# EAGLE design COPY VestibularVR H1-module v1.0 (EAGLE 9.6.2)
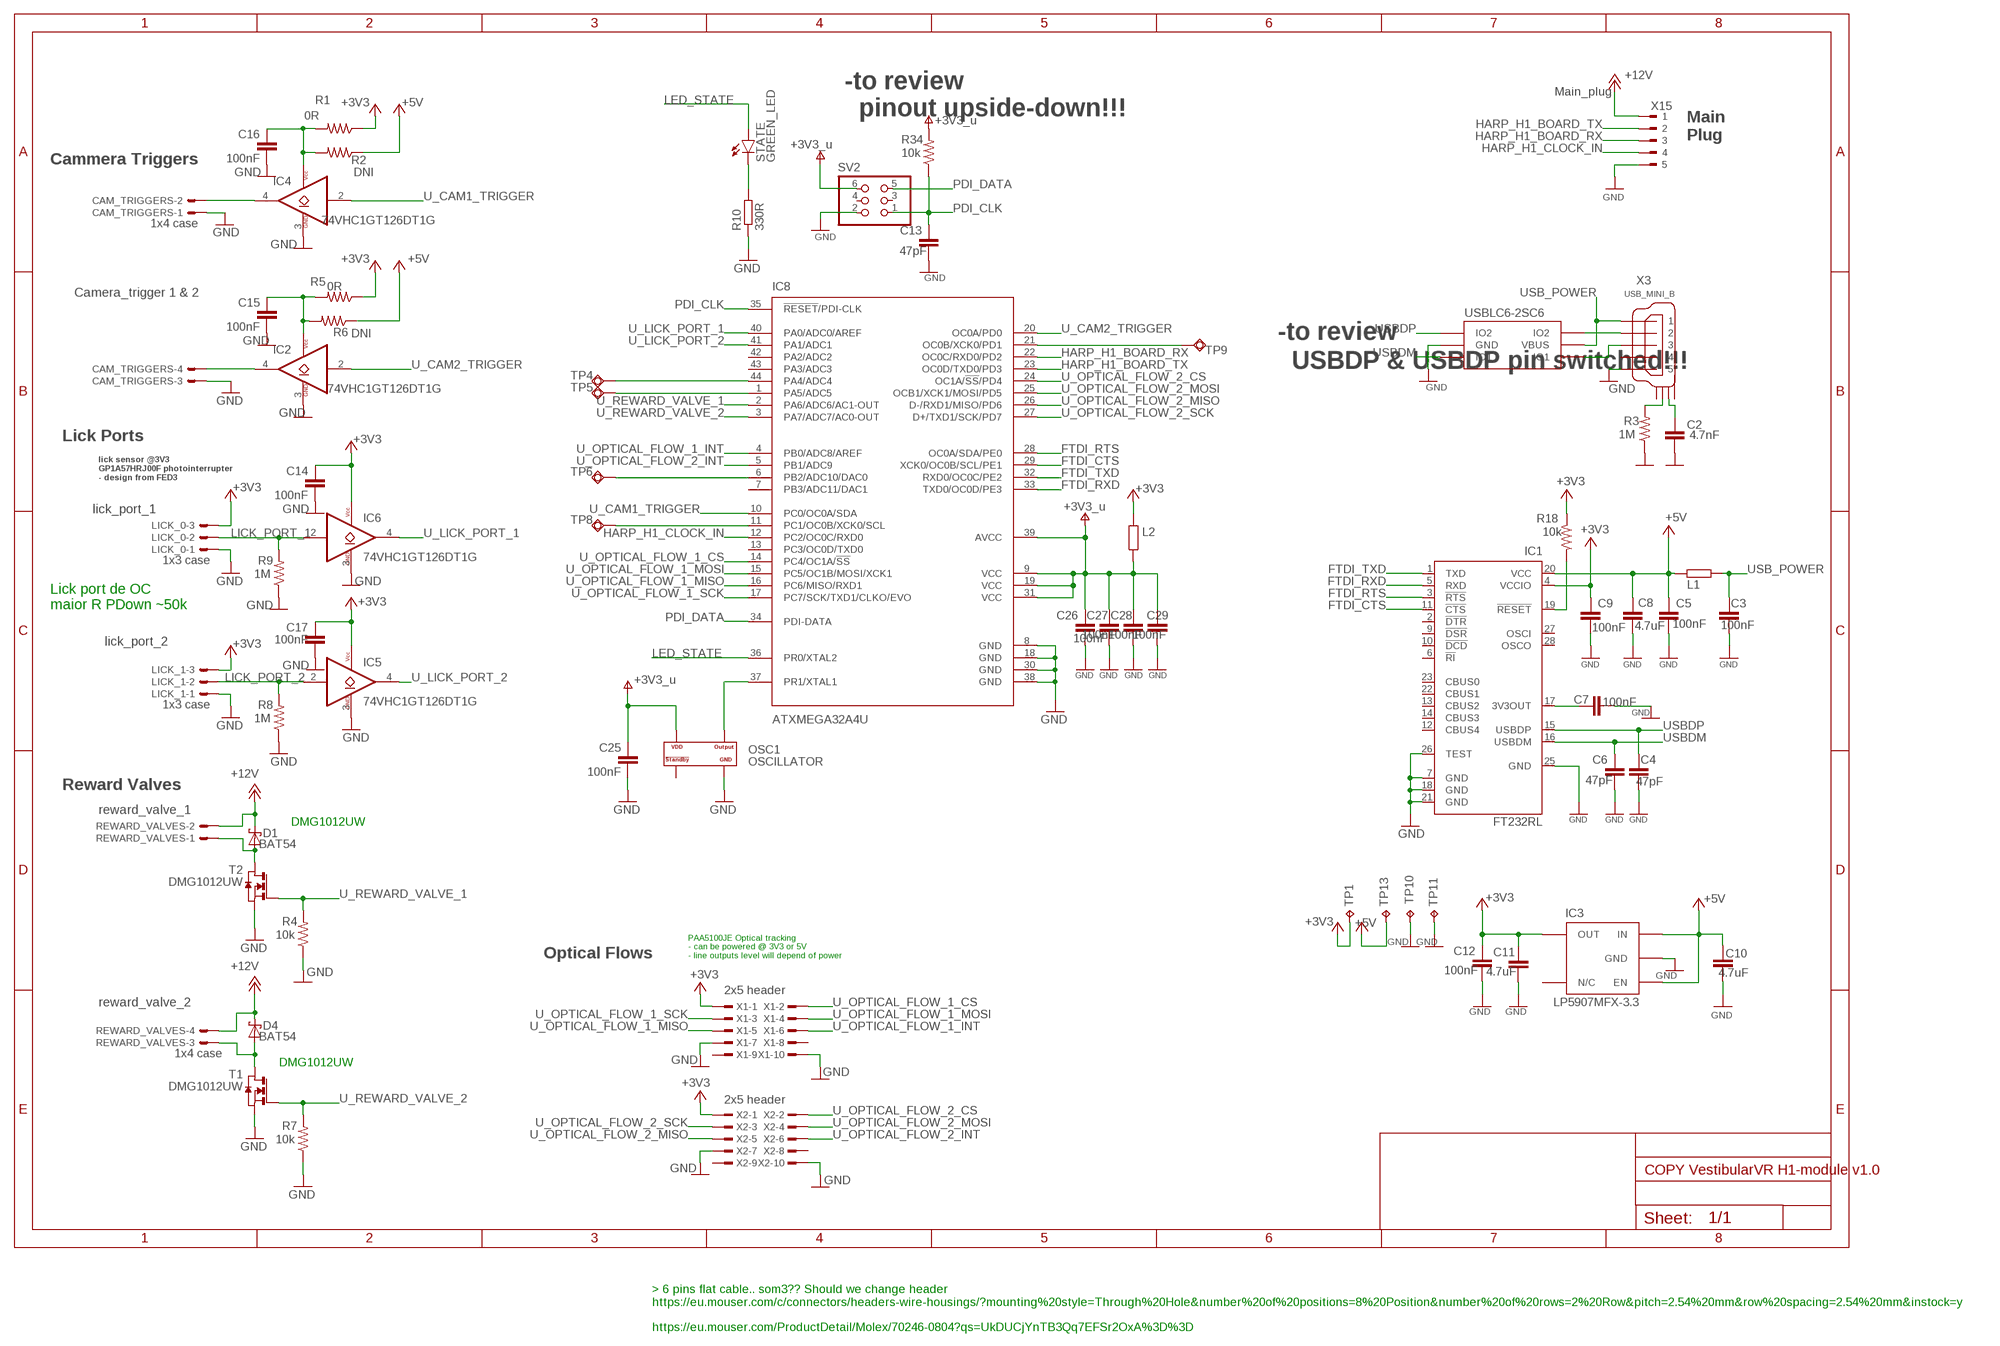
[diagram p0: schematic, sheet 1]

## Parts
C2  4.7nF  C-EUC0402K  [C0402K]
C3  100nF  C-EUC0402K  [C0402K]
C4  47pF  C-EUC0402K  [C0402K]
C5  100nF  C-EUC0402K  [C0402K]
C6  47pF  C-EUC0402K  [C0402K]
C7  100nF  C-EUC0402K  [C0402K]
C8  4.7uF  C-EUC0603  [C0603]
C9  100nF  C-EUC0402K  [C0402K]
C10  4.7uF  C-EUC0603K  [C0603K]
C11  4.7uF  C-EUC0603K  [C0603K]
C12  100nF  C-EUC0402K  [C0402K]
C13  47pF  C-EUC0402K  [C0402K]
C14  100nF  C-EUC0402K  [C0402K]
C15  100nF  C-EUC0402K  [C0402K]
C16  100nF  C-EUC0402K  [C0402K]
C17  100nF  C-EUC0402K  [C0402K]
C25  100nF  C-EUC0402K  [C0402K]
C26  100nF  C-EUC0402K  [C0402K]
C27  100nF  C-EUC0402K  [C0402K]
C28  100nF  C-EUC0402K  [C0402K]
C29  100nF  C-EUC0402K  [C0402K]
CAM_TRIGGERS  1x4 case  22-23-2041  [22-23-2041]
D1  BAT54  [SOT23]
D4  BAT54  [SOT23]
IC1  FT232RL  [SSOP28]
IC2  74VHC1GT126DT1G  74LVC1G07DBV  [SOT23-5]
IC3  LP5907MFX-3.3  TLV700XX  [TSOT23-5]
IC4  74VHC1GT126DT1G  74LVC1G07DBV  [SOT23-5]
IC5  74VHC1GT126DT1G  74LVC1G07DBV  [SOT23-5]
IC6  74VHC1GT126DT1G  74LVC1G07DBV  [SOT23-5]
IC7  USBLC6-2SC6  [SOT23-6L]
IC8  ATXMEGA32A4U  XMEGA-A4_AT-XMEGA-XXA4-AUTQFP44  [TQFP44]
L1  40R@100MHz  R-EU_R0603  [R0603]
L2  40R@100MHz  R-EU_R0603  [R0603]
LICK_0  1x3 case  22-23-2031  [22-23-2031]
LICK_1  1x3 case  22-23-2031  [22-23-2031]
OSC1  OSCILLATOR  [OSCILLATOR_3.2X2.5]
R1  0R  R-US_R0402  [R0402@1]
R2  DNI  R-US_R0402  [R0402@1]
R3  1M  R-US_R0402  [R0402@1]
R4  10k  R-US_R0402  [R0402@1]
R5  0R  R-US_R0402  [R0402@1]
R6  DNI  R-US_R0402  [R0402@1]
R7  10k  R-US_R0402  [R0402@1]
R8  1M  R-US_R0402  [R0402@1]
R9  1M  R-US_R0402  [R0402@1]
R10  330R  R-EU_R0402  [R0402]
R18  10k  R-US_R0402  [R0402@1]
R34  10k  R-US_R0402  [R0402@1]
REWARD_VALVES  1x4 case  22-23-2041  [22-23-2041]
STATE  GREEN_LED  LEDCHIP-LED0603  [CHIP-LED0603]
SV2  PINHD-2X3  [2X03]
T1  DMG1012UW  DMG1012UW-7  [SOT323]
T2  DMG1012UW  DMG1012UW-7  [SOT323]
TP1  NO_COMPONENT  TPB1,27  [B1,27]
TP4  NO_COMPONENT  TPSQTP11R  [TP11R]
TP5  NO_COMPONENT  TPSQTP11R  [TP11R]
TP6  NO_COMPONENT  TPSQTP11R  [TP11R]
TP8  NO_COMPONENT  TPSQTP11R  [TP11R]
TP9  NO_COMPONENT  TPSQTP11R  [TP11R]
TP10  NO_COMPONENT  TPB1,27  [B1,27]
TP11  NO_COMPONENT  TPB1,27  [B1,27]
TP13  NO_COMPONENT  TPB1,27  [B1,27]
X1  2x5 header  TSW-105-02-S-D  [TSW-105-02-S-D]
X2  2x5 header  TSW-105-02-S-D  [TSW-105-02-S-D]
X3  USB_MINI_B  [240-0002-1]
X15  Main_plug  90G-5  [90G-5]

## Nets
+3V3: C9.1 C11.1 C12.1 C14.1 C17.1 IC1.4(VCCIO) IC3.5(OUT) IC5.5(VCC) IC6.5(VCC) L2.2 LICK_0.3 LICK_1.3 R1.1 R5.1 R18.1 TP1.TP X1.1 X2.1
+3V3_U: C25.1 C26.1 C27.1 C28.1 C29.1 IC8.9(VCC) IC8.19(VCC) IC8.31(VCC) IC8.39(AVCC) L2.1 OSC1.P$4(VDD) R34.2 SV2.6 ; supply symbol labelled +3V3_u
+5V: C5.1 C8.1 C10.1 IC1.20(VCC) IC3.1(IN) IC3.3(EN) L1.1 R2.1 R6.1 TP13.TP
+12V: D1.3(C) D4.3(C) REWARD_VALVES.2 REWARD_VALVES.4 X15.1
FTDI_CTS: IC1.11(!CTS) IC8.29(XCK0/OC0B/SCL/PE1)
FTDI_RTS: IC1.3(!RTS) IC8.28(OC0A/SDA/PE0)
FTDI_RXD: IC1.5(RXD) IC8.33(TXD0/OC0D/PE3)
FTDI_TXD: IC1.1(TXD) IC8.32(RXD0/OC0C/PE2)
GND: C2.2 C3.2 C4.2 C5.2 C6.2 C7.2 C8.2 C9.2 C10.2 C11.2 C12.2 C13.2 C14.2 C15.2 C16.2 C17.2 C25.2 C26.2 C27.2 C28.2 C29.2 CAM_TRIGGERS.1 CAM_TRIGGERS.3 IC1.7(GND) IC1.18(GND) IC1.21(GND) IC1.25(GND) IC1.26(TEST) IC2.3(GND) IC3.2(GND) IC4.3(GND) IC5.3(GND) IC6.3(GND) IC7.P$2(GND) IC8.8(GND) IC8.18(GND) IC8.30(GND) IC8.38(GND) LICK_0.1 LICK_1.1 OSC1.P$2(GND) R3.1 R4.1 R7.1 R8.1 R9.1 R10.1 SV2.2 T1.2(S) T2.2(S) TP10.TP TP11.TP X1.7 X1.10 X2.7 X2.10 X3.P$5 X15.5
HARP_H1_BOARD_RX: IC8.22(OC0C/RXD0/PD2) X15.3
HARP_H1_BOARD_TX: IC8.23(OC0D/TXD0/PD3) X15.2
HARP_H1_CLOCK_IN: IC8.12(PC2/OC0C/RXD0) X15.4
LED_STATE: IC8.36(PR0/XTAL2) STATE.A
LICK_PORT_1: IC6.2(A) LICK_0.2 R9.2
LICK_PORT_2: IC5.2(A) LICK_1.2 R8.2
N$1: R3.2 X3.SHIELD_2
N$2: IC7.P$4(IO2) X3.P$2
N$3: IC7.P$6(IO1) X3.P$3
N$4: CAM_TRIGGERS.4 IC2.4(Y)
N$5: C16.1 IC4.5(VCC) R1.2 R2.2
N$6: D4.1(A) REWARD_VALVES.3 T1.3(D)
N$8: CAM_TRIGGERS.2 IC4.4(Y)
N$9: R10.2 STATE.C
N$11: IC8.44(PA4/ADC4) TP4.TP
N$12: IC8.1(PA5/ADC5) TP5.TP
N$13: IC8.6(PB2/ADC10/DAC0) TP6.TP
N$14: C15.1 IC2.5(VCC) R5.2 R6.2
N$15: C2.1 X3.SHIELD_3
N$17: IC8.11(PC1/OC0B/XCK0/SCL) TP8.TP
N$18: IC8.21(OC0B/XCK0/PD1) TP9.TP
N$38: C7.1 IC1.17(3V3OUT)
N$68: D1.1(A) REWARD_VALVES.1 T2.3(D)
N$175: IC1.19(!RESET) R18.2
OSC2: IC8.37(PR1/XTAL1) OSC1.P$3(OUTPUT)
PDI_CLK: C13.1 IC8.35(!RESET!/PDI-CLK) R34.1 SV2.1
PDI_DATA: IC8.34(PDI-DATA) SV2.5
U_CAM1_TRIGGER: IC4.2(A) IC8.10(PC0/OC0A/SDA)
U_CAM2_TRIGGER: IC2.2(A) IC8.20(OC0A/PD0)
U_LICK_PORT_1: IC6.4(Y) IC8.40(PA0/ADC0/AREF)
U_LICK_PORT_2: IC5.4(Y) IC8.41(PA1/ADC1)
U_OPTICAL_FLOW_1_CS: IC8.14(PC4/OC1A/!SS) X1.2
U_OPTICAL_FLOW_1_INT: IC8.4(PB0/ADC8/AREF) X1.6
U_OPTICAL_FLOW_1_MISO: IC8.16(PC6/MISO/RXD1) X1.5
U_OPTICAL_FLOW_1_MOSI: IC8.15(PC5/OC1B/MOSI/XCK1) X1.4
U_OPTICAL_FLOW_1_SCK: IC8.17(PC7/SCK/TXD1/CLKO/EVO) X1.3
U_OPTICAL_FLOW_2_CS: IC8.24(OC1A/!SS!/PD4) X2.2
U_OPTICAL_FLOW_2_INT: IC8.5(PB1/ADC9) X2.6
U_OPTICAL_FLOW_2_MISO: IC8.26(D-/RXD1/MISO/PD6) X2.5
U_OPTICAL_FLOW_2_MOSI: IC8.25(OCB1/XCK1/MOSI/PD5) X2.4
U_OPTICAL_FLOW_2_SCK: IC8.27(D+/TXD1/SCK/PD7) X2.3
U_REWARD_VALVE_1: IC8.2(PA6/ADC6/AC1-OUT) R4.2 T2.1(G)
U_REWARD_VALVE_2: IC8.3(PA7/ADC7/AC0-OUT) R7.2 T1.1(G)
USB_POWER: C3.1 IC7.P$5(VBUS) L1.2 X3.P$1
USBDM: C6.1 IC1.16(USBDM) IC7.P$1(IO1)
USBDP: C4.1 IC1.15(USBDP) IC7.P$3(IO2)
Unconnected: IC1.2(!DTR) IC1.6(!RI) IC1.9(!DSR) IC1.10(!DCD) IC1.12(CBUS4) IC1.13(CBUS2) IC1.14(CBUS3) IC1.22(CBUS1) IC1.23(CBUS0) IC1.27(OSCI) IC1.28(OSCO) IC2.1(NC) IC3.4(N/C) IC4.1(NC) IC5.1(NC) IC6.1(NC) IC8.7(PB3/ADC11/DAC1) IC8.13(PC3/OC0D/TXD0) IC8.42(PA2/ADC2) IC8.43(PA3/ADC3) OSC1.P$1(STANDBY#) SV2.3 SV2.4 X1.8 X1.9 X2.8 X2.9 X3.P$4 X3.SHIELD_1 X3.SHIELD_4

## Notes on the sheet
- -to review
    pinout upside-down!!!
- Main 
  Plug
- Cammera Triggers
- Camera_trigger 1 & 2
- -to review
    USBDP & USBDP pin switched!!!
- Lick Ports
- lick sensor @3V3
  GP1A57HRJ00F photointerrupter
  - design from FED3
- lick_port_1
- Lick port de OC
  maior R PDown ~50k
- lick_port_2
- Reward Valves
- reward_valve_1
- DMG1012UW
- Optical Flows
- PAA5100JE Optical tracking
  - can be powered @ 3V3 or 5V
  - line outputs level will depend of power
- reward_valve_2
- DMG1012UW
- > 6 pins flat cable.. som3?? Should we change header
  https://eu.mouser.com/c/connectors/headers-wire-housings/?mounting%20style=Through%20Hole&number%20of%20positions=8%20Position&number%20of%20rows=2%20Row&pitch=2.54%20mm&row%20spacing=2.54%20mm&instock=y
  
  https://eu.mouser.com/ProductDetail/Molex/70246-0804?qs=UkDUCjYnTB3Qq7EFSr2OxA%3D%3D

## Library data of the parts
C2 = rcl:C-EU: CAPACITOR, European symbol; MPN: CC0402KRX7R8BB472; OEPS: OEPS010001
C3 C5 C7 C9 C12 C14-C17 C25-C29 = rcl:C-EU: CAPACITOR, European symbol; DIGIKEY_PN: 445-5932-1-ND; MPN: C1005X7R1H104K050BB; NOTES: -; OEPS: OEPS010004; TYPE: SMD
C4 C6 C13 = rcl:C-EU: CAPACITOR, European symbol; MPN: 04025A470JAT2A; OEPS: OEPS080013
C8 = rcl:C-EU: CAPACITOR, European symbol; MPN: C1608X6S1C475K080AC; OEPS: OEPS010018
C10 C11 = rcl:C-EU: CAPACITOR, European symbol; MPN: C1608X6S1C475K080AC; NOTES: -; OEPS: OEPS010018; TYPE: SMD
CAM_TRIGGERS REWARD_VALVES = con-molex:22-23-2041: .100" (2.54mm) Center Header - 4 Pin; MF: -; MPN: 282834-4; OC_FARNELL: 1462920; OC_NEWARK: 38C0355; OEPS: OEPS070036
D1 D4 = diode:BAT54: Schottky Diodes Source: Fairchild .. BAT54.pdf; MPN: BAT54SLT1G; OEPS: OEPS030003
IC1 = VestibularVR H1-module v1.0:FT232R: UART/FIFO IC; MPN: FT232RL; OEPS: OEPS080013
IC2 IC4-IC6 = VestibularVR H1-module v1.0:74LVC1G07: Single Buffer/Driver With Open-Drain Output; MPN: M74VHC1GT126DT1G; OEPS: OEPS080017
IC3 = VestibularVR H1-module v1.0:TLV700XX: C REG LINEAR 3.3V 200MA SOT23-5; MPN: LP5907MFX-3.3/NOPB; NOTES: -; OEPS: OEPS080016; TYPE: SMD
IC7 = VestibularVR H1-module v1.0:USBLC6-2SC6: TVS DIODE 5.25VWM 17VC SOT23-6; MPN: USBLC6-2SC6; OEPS: OEPS030010
IC8 = VestibularVR H1-module v1.0:XMEGA-A4_AT-XMEGA-XXA4-AU: ATxMega a4 Serie; DIGIKEY_PN: ATXMEGA32A4U-AURCT-ND; MOUSER_PN: 556-ATXMEGA32A4U-AU; MPN: ATXMEGA32A4U-AUR; OEPS: OEPS080012
L1 L2 = rcl:R-EU_: RESISTOR, European symbol; MPN: MI0805K400R-10; OEPS: OEPS040003; SPICEPREFIX: R
LICK_0 LICK_1 = con-molex:22-23-2031: .100" (2.54mm) Center Header - 3 Pin; MF: -; MPN: 282834-3; OC_FARNELL: 1462950; OC_NEWARK: 30C0862; OEPS: OEPS070035
OSC1 = VestibularVR H1-module v1.0:OSCILLATOR: XTAL OSC TCXO 32.0000MHZ HCMOS; MPN: DSC1001CI5-032.0000; OEPS: OEPS080018
R1 R5 = rcl:R-US_: RESISTOR, American symbol; MPN: RC0402JR-070RL; OEPS: OEPS020001
R2 R6 = rcl:R-US_: RESISTOR, American symbol; MPN: DNI; OEPS: DNI
R3 R8 R9 = rcl:R-US_: RESISTOR, American symbol; DIGIKEY_PN: 541-1.00MLCT-ND; MPN: CRCW04021M00FKED; OEPS: OEPS020026
R4 R7 R18 R34 = rcl:R-US_: RESISTOR, American symbol; DIGIKEY_PN: 541-10.0KLDKR-ND; MPN: CRCW040210K0FKED; OEPS: OEPS020030
R10 = rcl:R-EU_: RESISTOR, European symbol; MPN: RC0402FR-07330RL; OEPS: OEPS020037; SPICEPREFIX: R
STATE = led:LED: LED OSRAM: - CHIPLED LG R971, LG N971, LY N971, LG Q971, LY Q971, LO R971, LY R971 LH N974, LH R974 LS Q976, LO Q976, LY Q976 LO Q996 - Hyper CHIPLED LW Q18S LB Q993, LB Q99A, LB R99A - SideLED LS A670, LO A670, LY A670, LG A670, LP A670 LB A673, LV A673, LT A673, LW A673 LH A674 LY A675 LS A676, LA A676, LO A676, LY A676, LW A676 LS A679, LY A679, LG A679 - Hyper Micro SIDELED® LS Y876, LA Y876, LO Y876, LY Y876 LT Y87S - SmartLED LW L88C, LW L88S LB L89C, LB L89S, LG L890 LS L89K, LO L89K, LY L89K LS L896, LA L896, LO L896, LY L896 - TOPLED LS T670, LO T670, LY T670, LG T670, LP T670 LSG T670, LSP T670, LSY T670, LOP T670, LYG T670 LG T671, LOG T671, LSG T671 LB T673, LV T673, LT T673, LW T673 LH T674 LS T676, LA T676, LO T676, LY T676, LB T676, LH T676, LSB T676, LW T676 LB T67C, LV T67C, LT T67C, LS T67K, LO T67K, LY T67K, LW E67C LS E67B, LA E67B, LO E67B, LY E67B, LB E67C, LV E67C, LT E67C LW T67C LS T679, LY T679, LG T679 LS T770, LO T770, LY T770, LG T770, LP T770 LB T773, LV T773, LT T773, LW T773 LH T774 LS E675, LA E675, LY E675, LS T675 LS T776, LA T776, LO T776, LY T776, LB T776 LHGB T686 LT T68C, LB T68C - Hyper Mini TOPLED® LB M676 - Mini TOPLED Santana® LG M470 LS M47K, LO M47K, LY M47K Source: http://www.osram.convergy.de LUXEON: - LUMILED® LXK2-PW12-R00, LXK2-PW12-S00, LXK2-PW14-U00, LXK2-PW14-V00 LXK2-PM12-R00, LXK2-PM12-S00, LXK2-PM14-U00 LXK2-PE12-Q00, LXK2-PE12-R00, LXK2-PE12-S00, LXK2-PE14-T00, LXK2-PE14-U00 LXK2-PB12-K00, LXK2-PB12-L00, LXK2-PB12-M00, LXK2-PB14-N00, LXK2-PB14-P00, LXK2-PB14-Q00 LXK2-PR12-L00, LXK2-PR12-M00, LXK2-PR14-Q00, LXK2-PR14-R00 LXK2-PD12-Q00, LXK2-PD12-R00, LXK2-PD12-S00 LXK2-PH12-R00, LXK2-PH12-S00 LXK2-PL12-P00, LXK2-PL12-Q00, LXK2-PL12-R00 Source: www.luxeon.com KINGBRIGHT: KA-3528ASYC Source: www.kingbright.com; MPN: LTST-C191KGKT; OEPS: OEPS030005
SV2 = Connector:PINHD-2X3: PIN HEADER; CATEGORY: CONNECTOR; MPN: 609-3210-ND; OEPS: OEPS070015; SUB-CATEGORY: PIN-HEADER
T1 T2 = VestibularVR H1-module v1.0:DMG1012UW-7: N-CHANNEL ENHANCEMENT MODE MOSFET; MPN: DMG1012UW-7; OEPS: OEPS060010
TP1 TP10 TP11 TP13 = testpad:TP: Test pad
TP4-TP6 TP8 TP9 = testpad:TPSQ: Test pad
X1 X2 = con-samtec:TSW-105-02-S-D: THROUGH-HOLE .025" SQ POST HEADER Source: Samtec TSW.pdf; MPN: 2x5 header; OC_FARNELL: unknown; OC_NEWARK: unknown; OEPS: n.a.
X3 = VestibularVR H1-module v1.0:USB_MINI_B: CONN RCPT USB2.0 MINI B SMD R/A; MPN: UX60-MB-5S8; OEPS: OEPS070021
X15 = con-weidmueller-sl35:90G-5: WEIDMUELLER CLAMP CONNECTOR; MPN: 20.155MH/5-E; OC_FARNELL: unknown; OC_NEWARK: unknown; OEPS: OEPS070037

## Net classes
0 default: clearance 0.205 mm

## Board
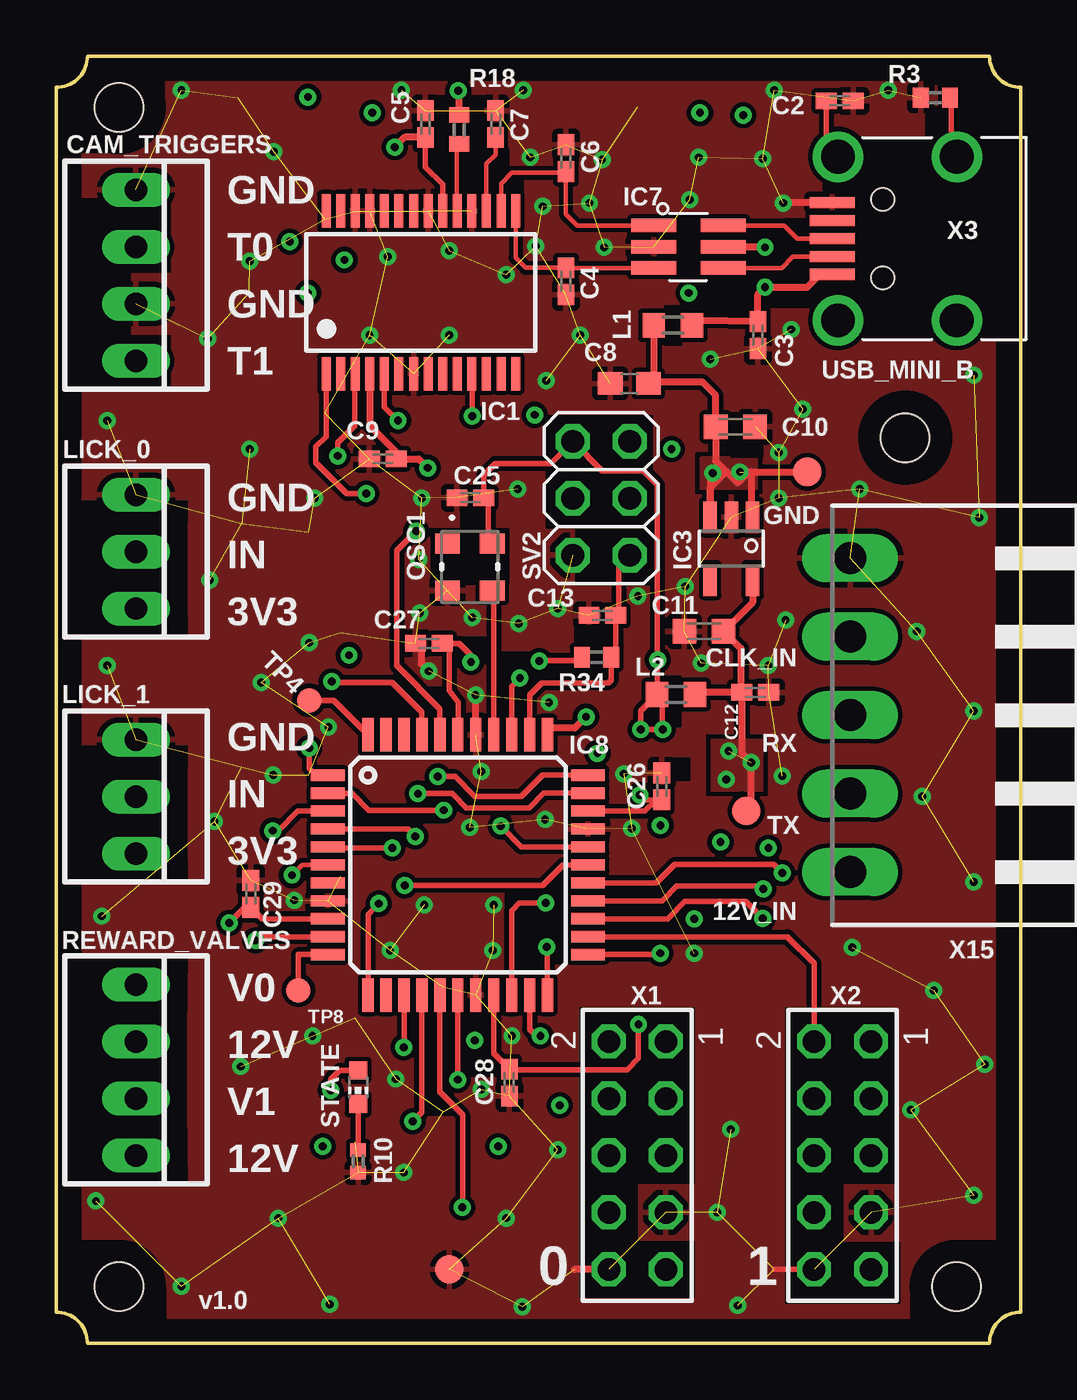
[diagram p1: board, top side]
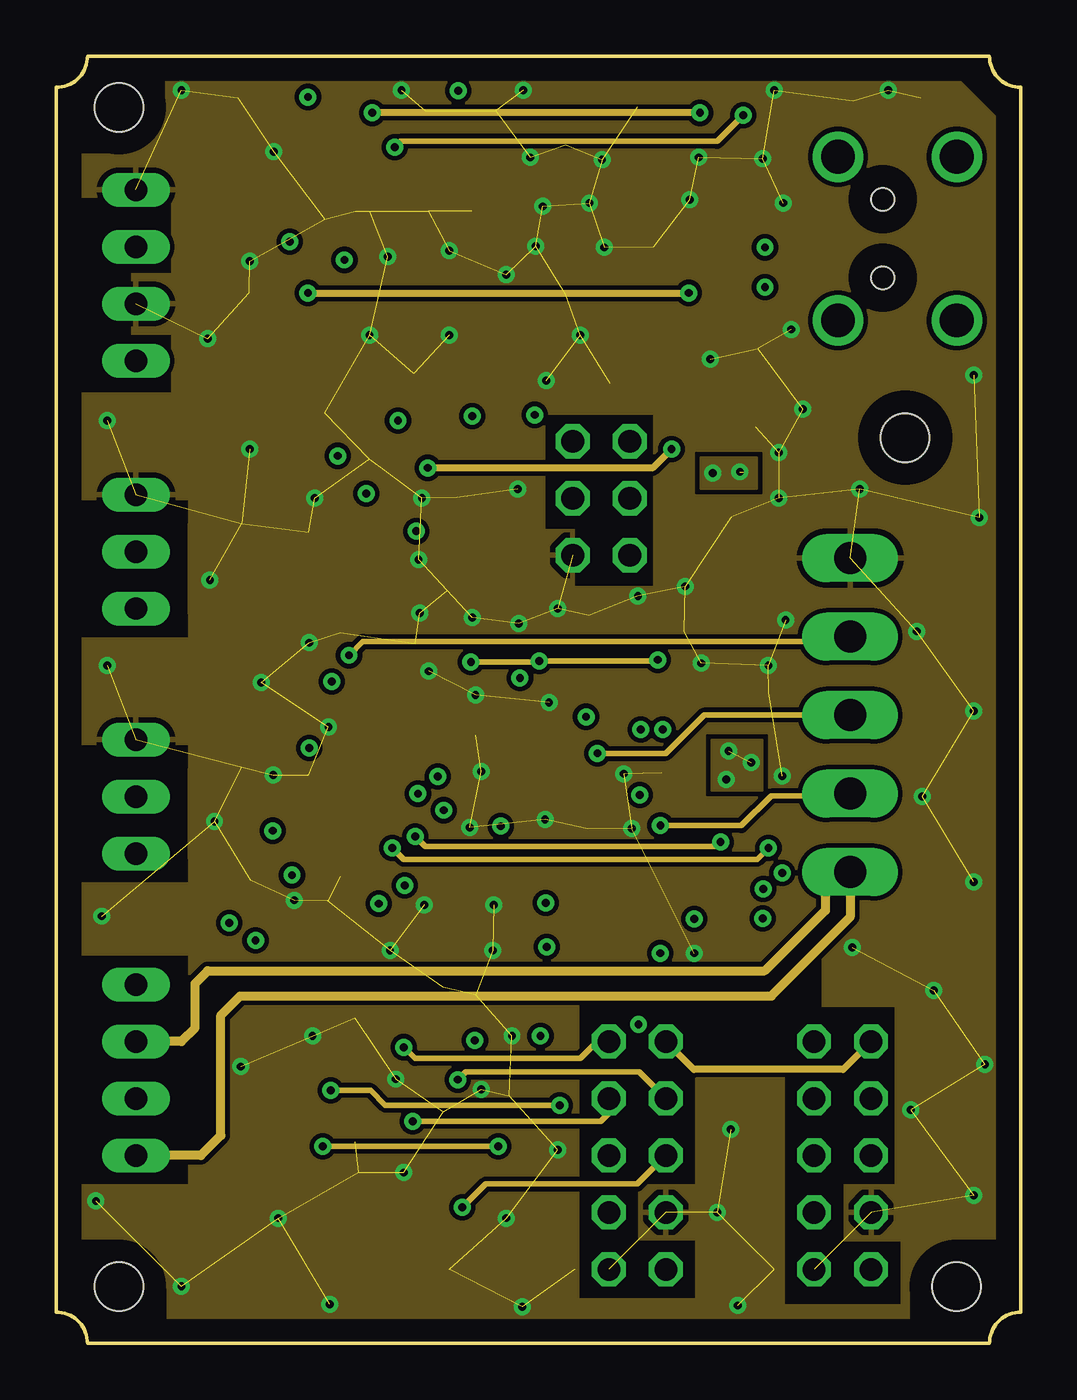
[diagram p2: board, inner layer Route2]
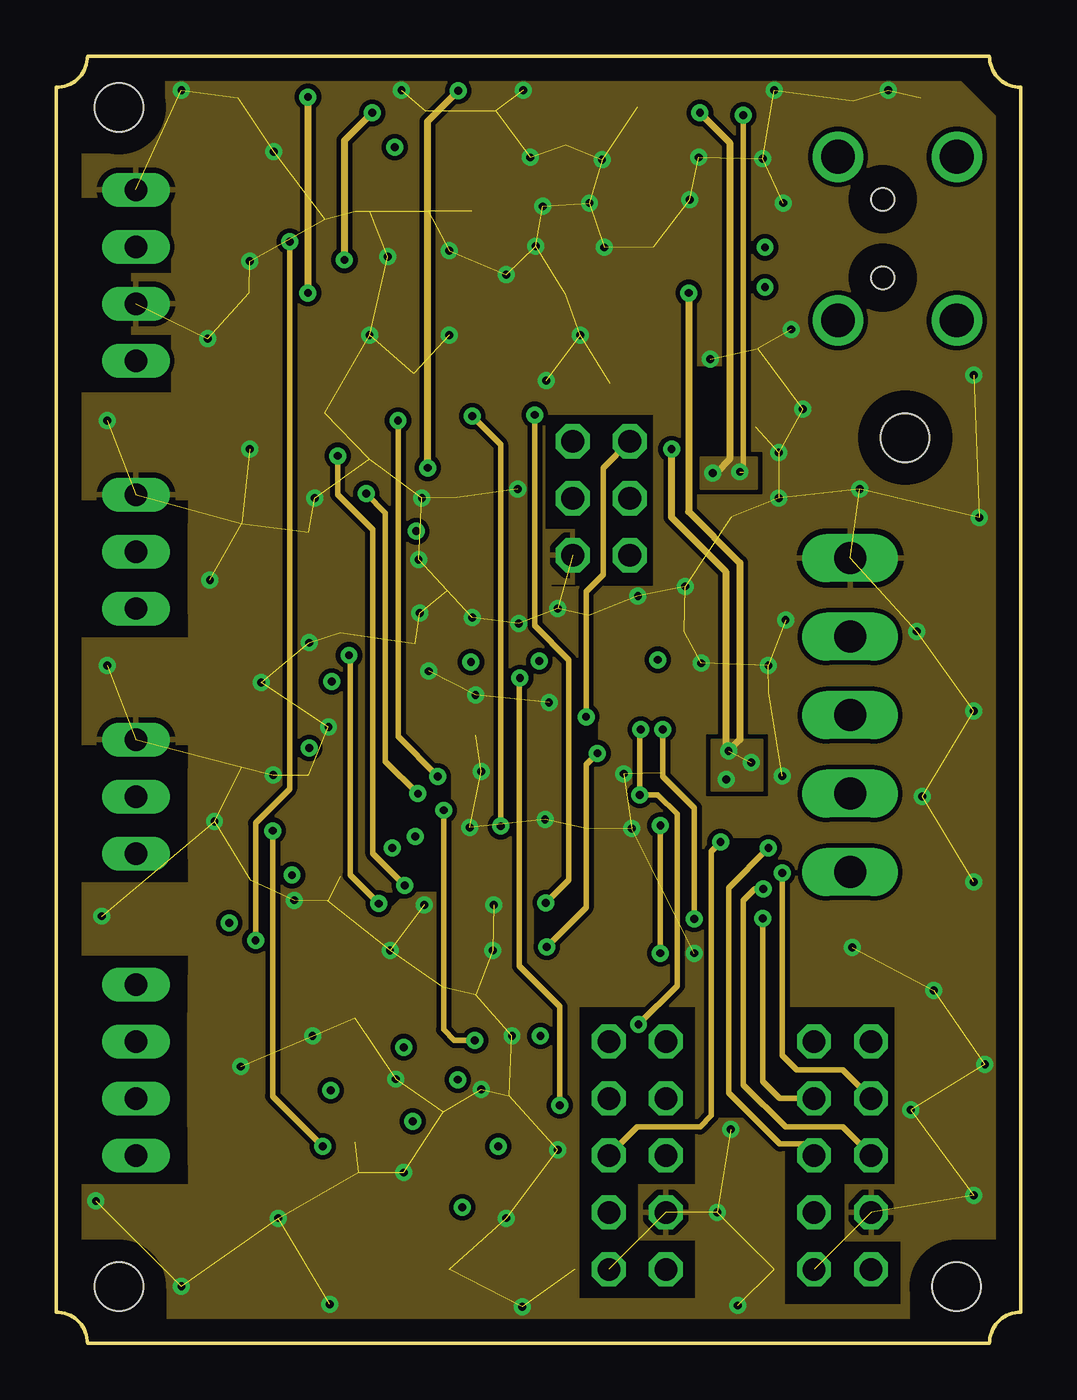
[diagram p3: board, inner layer Route15]
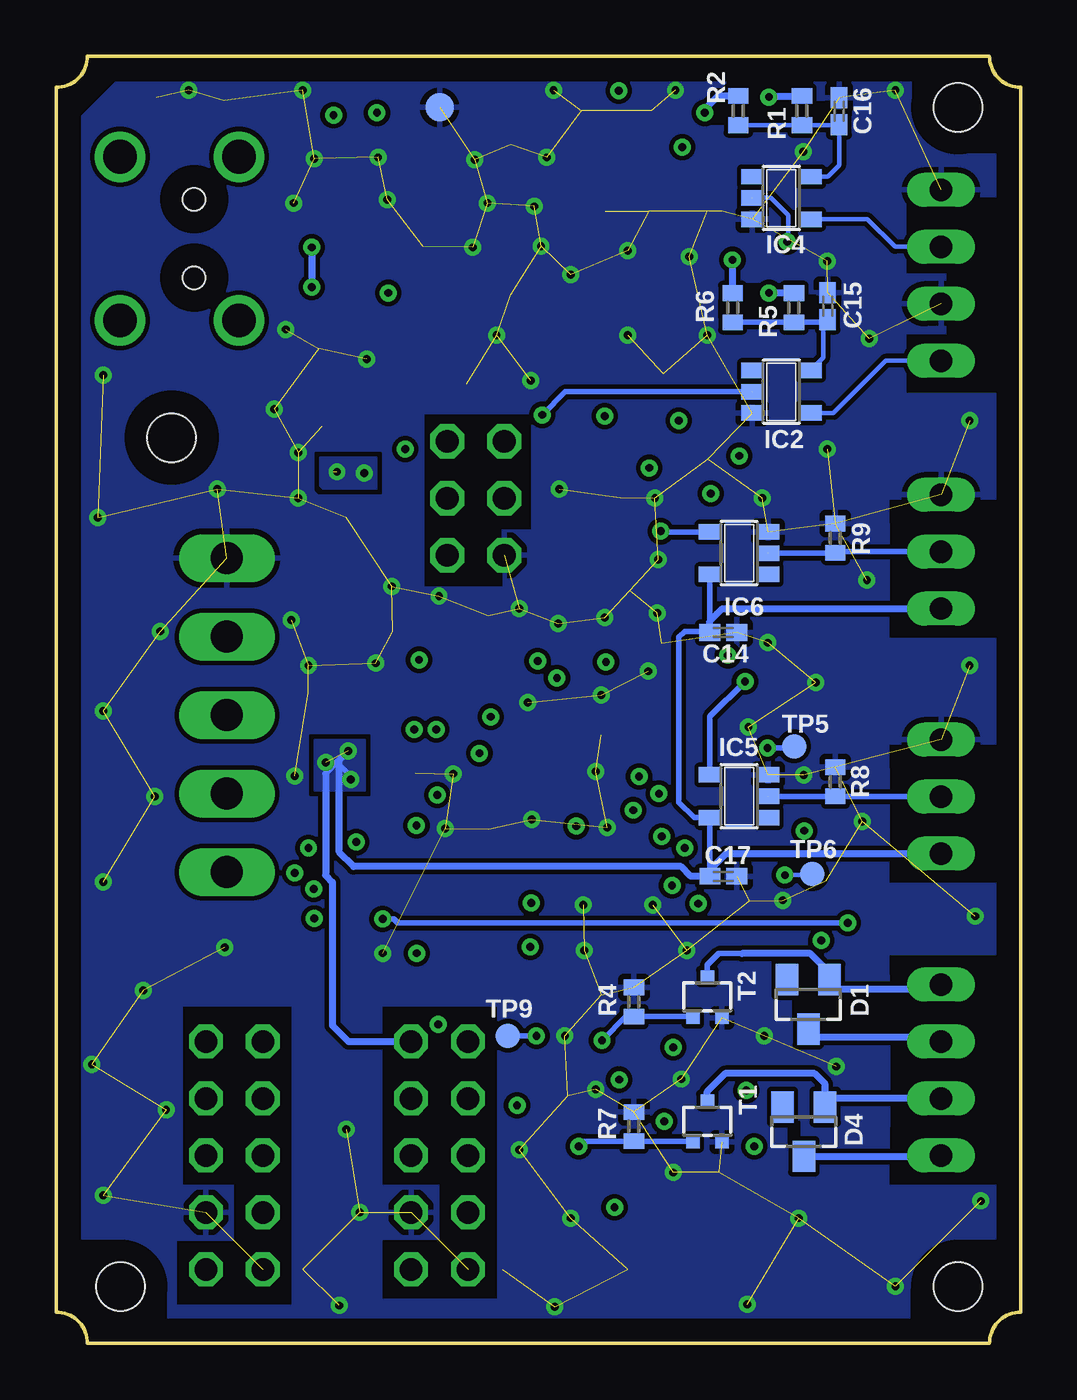
[diagram p4: board, bottom side, seen from below]

Size 43 x 57.4 mm. Coordinates in mm from the lower left corner, seen from the top.
Outline: 41.6,57.4 1.4,57.4 arc-90 0,56 0,1.4 arc-90 1.4,0 41.6,0 arc-90 43,1.4 43,55.1 43,56 arc-90 41.6,57.4
Copper layers (1+2*15+16): Top 0.035mm / dielectric 0.2mm / Route2 0.035mm / dielectric 0.15mm / Route15 0.035mm / dielectric 0.2mm / Bottom 0.035mm
Design rules "default *": minimum track width 6mil, minimum drill 0.35mm, track to track 6mil, track to pad 6mil, pad to pad 6mil, via to via 6mil, smd to smd 6mil, copper to edge 40mil, drill to drill 6mil, minimum pad ring 10mil, minimum via ring 8mil, stop-mask expansion 4mil, vias tented up to drill 0mil, thermal gap 10mil
Holes 2.15 mm at 2.79,2.54 2.79,55.12 40.13,2.54 37.85,40.39

### Footprints (pad centres in the part's own frame; a part is rotated, then mirrored left to right if it is on the bottom)
C0402K = smd 0.925 x 0.74: 1 -0.6,0; 2 0.6,0
C0603 = smd 1.1 x 1: 1 -0.85,0; 2 0.85,0
C0603K = smd 1.05 x 1.08: 1 -0.875,0; 2 0.875,0
22-23-2041 = drill 1 long: 1 -3.81,0; 2 -1.27,0; 3 1.27,0; 4 3.81,0
SOT23 = smd 1 x 1.4: 1 -0.95,-1.1; 2 0.95,-1.1; 3 0,1.1
SSOP28 = smd 0.4 x 1.5: 1 -4.225,-3.625; 2 -3.575,-3.625; 3 -2.925,-3.625; 4 -2.275,-3.625; 5 -1.625,-3.625; 6 -0.975,-3.625; 7 -0.325,-3.625; 8 0.325,-3.625; 9 0.975,-3.625; 10 1.625,-3.625; 11 2.275,-3.625; 12 2.925,-3.625; 13 3.575,-3.625; 14 4.225,-3.625; 15 4.225,3.625; 16 3.575,3.625; 17 2.925,3.625; 18 2.275,3.625; 19 1.625,3.625; 20 0.975,3.625; 21 0.325,3.625; 22 -0.325,3.625; 23 -0.975,3.625; 24 -1.625,3.625; 25 -2.275,3.625; 26 -2.925,3.625; 27 -3.575,3.625; 28 -4.225,3.625
SOT23-5 = smd 0.69 x 0.99: 1 -0.95,-1.29; 2 0,-1.29; 3 0.95,-1.29; 4 0.95,1.3; 5 -0.95,1.3
TSOT23-5 = smd 0.6 x 1.408: 1 -0.95,-1.404; 2 0,-1.404; 3 0.95,-1.404; 4 0.95,1.404; 5 -0.95,1.404
SOT23-6L = smd 0.6 x 2: P$1 -0.95,-1.55; P$2 0,-1.55; P$3 0.95,-1.55; P$4 0.95,1.55; P$5 0,1.55; P$6 -0.95,1.55
TQFP44 = smd 1.5 x 0.5: 1 -5.8,4; 2 -5.8,3.2; 3 -5.8,2.4; 4 -5.8,1.6; 5 -5.8,0.8; 6 -5.8,0; 7 -5.8,-0.8; 8 -5.8,-1.6; 9 -5.8,-2.4; 10 -5.8,-3.2; 11 -5.8,-4; 23 5.8,-4; 24 5.8,-3.2; 25 5.8,-2.4; 26 5.8,-1.6; 27 5.8,-0.8; 28 5.8,0; 29 5.8,0.8; 30 5.8,1.6; 31 5.8,2.4; 32 5.8,3.2; 33 5.8,4 | smd 0.5 x 1.5: 12 -4,-5.8; 13 -3.2,-5.8; 14 -2.4,-5.8; 15 -1.6,-5.8; 16 -0.8,-5.8; 17 0,-5.8; 18 0.8,-5.8; 19 1.6,-5.8; 20 2.4,-5.8; 21 3.2,-5.8; 22 4,-5.8; 34 4,5.8; 35 3.2,5.8; 36 2.4,5.8; 37 1.6,5.8; 38 0.8,5.8; 39 0,5.8; 40 -0.8,5.8; 41 -1.6,5.8; 42 -2.4,5.8; 43 -3.2,5.8; 44 -4,5.8
R0603 = smd 1 x 1.1: 1 -0.85,0; 2 0.85,0
22-23-2031 = drill 1 long: 1 -2.54,0; 2 0,0; 3 2.54,0
OSCILLATOR_3.2X2.5 = smd 0.9 x 1.1: P$1 -1.05,-1; P$2 1.05,-1; P$3 1.05,1; P$4 -1.05,1
R0402@1 = smd 0.7 x 0.9: 1 -0.65,0; 2 0.65,0
R0402 = smd 0.6 x 0.7: 1 -0.5,0; 2 0.5,0
CHIP-LED0603 = smd 0.8 x 0.8: A 0,-0.75; C 0,0.75
2X03 = drill 1.016 octagon: 1 -2.54,-1.27; 2 -2.54,1.27; 3 0,-1.27; 4 0,1.27; 5 2.54,-1.27; 6 2.54,1.27
SOT323 = smd 0.6 x 0.55: 1 -0.65,-0.925; 2 0.65,-0.925; 3 0,0.925
B1,27 = smd 1.27 x 1.27: TP 0,0
TP11R = smd 1.1 x 1.1: TP 0,0
TSW-105-02-S-D = drill 1 pad 1.5 octagon: 1 5.08,-1.27; 2 5.08,1.27; 3 2.54,-1.27; 4 2.54,1.27; 5 0,-1.27; 6 0,1.27; 7 -2.54,-1.27; 8 -2.54,1.27; 9 -5.08,-1.27; 10 -5.08,1.27
240-0002-1 = smd 0.5 x 2: P$1 -1.6,8.65; P$2 -0.8,8.65; P$3 0,8.65; P$4 0.8,8.65; P$5 1.6,8.65 | drill 1.5: SHIELD_1 -3.65,3.1; SHIELD_2 3.65,3.1; SHIELD_3 3.65,8.4; SHIELD_4 -3.65,8.4 | hole 1: -1.75,6.4; 1.75,6.4
90G-5 = drill 1.422 long: 1 -7,5.25; 2 -3.5,5.25; 3 0,5.25; 4 3.5,5.25; 5 7,5.25

### Placement (x,y rotation side)
C2  34.93,55.41 0 top
C3  31.28,44.96 270 top
C4  22.73,47.35 270 top
C5  16.46,54.37 90 top
C6  22.73,52.85 90 top
C7  19.59,54.37 90 top
C8  25.55,42.8 180 top
C9  14.56,39.44 180 top
C10  30.28,40.87 0 top
C11  28.88,31.75 180 top
C12  31.17,29.03 0 top
C13  24.35,32.46 180 top
C14  13.26,31.7 0 bottom
C15  8.61,46.25 90 bottom
C16  8.1,54.94 90 bottom
C17  13.26,20.83 0 bottom
C25  18.46,37.71 180 top
C26  26.99,24.84 90 top
C27  16.61,31.21 180 top
C28  20.2,11.63 270 top
C29  8.68,20.04 90 top
CAM_TRIGGERS  3.56,47.62 270 top
D1  9.47,15.12 180 bottom
D4  9.67,9.44 180 bottom
IC1  16.26,46.86 0 top
IC2  10.68,42.44 270 bottom
IC3  30.1,35.43 180 top
IC4  10.68,51.07 270 bottom
IC5  12.56,24.4 90 bottom
IC6  12.56,35.24 90 bottom
IC7  28.19,48.9 270 top
IC8  17.91,21.34 0 top
L1  27.49,45.4 0 top
L2  27.64,28.93 0 top
LICK_0  3.56,35.31 270 top
LICK_1  3.56,24.38 270 top
OSC1  18.44,34.62 270 top
R1  9.76,54.97 270 bottom
R2  12.59,54.97 270 bottom
R3  39.19,55.54 0 top
R4  17.25,15.22 270 bottom
R5  10.11,46.18 270 bottom
R6  12.85,46.18 270 bottom
R7  17.25,9.67 270 bottom
R8  8.27,25.04 270 bottom
R9  8.27,35.91 270 bottom
R10  13.46,8.13 90 top
R18  17.97,54.13 270 top
R34  24.09,30.59 180 top
REWARD_VALVES  3.56,12.19 270 top
STATE  13.46,11.43 180 top
SV2  24.3,37.68 90 top
T1  13.97,9.91 0 bottom
T2  13.97,15.44 0 bottom
TP1  30.76,23.75 0 top
TP4  11.28,28.68 0 top
TP5  10.11,26.62 0 bottom
TP6  9.3,20.93 0 bottom
TP8  10.79,15.75 0 top
TP9  22.86,13.72 0 bottom
TP10  17.53,3.3 0 top
TP11  25.91,55.12 0 bottom
TP13  33.48,38.86 0 top
X1  25.91,8.38 90 top
X2  35.05,8.38 90 top
X3  43.25,49.26 90 top
X15  40.64,28.02 90 top

### Tracks (layer width: path | path; a pad name or v marks a point on that pad's centre or on a via)
1
  cutout Top: 18.14,12.45 19.96,12.45 19.96,11.94 18.14,11.94
123
  cutout Top: 18.29,14.73 19.05,14.73 19.05,14.22 18.29,14.22
+3V3  (via drill 0.35)  (1 unrouted)
  Top 0.305: IC1.4 13.98,40.92 15.21,39.7 C9.1 16.16,39.44 v16.56,39.04 | IC3.5 31.05,33.04 C11.1 30.52,30.99 30.52,29.03 C12.1 | C12.1 28.59,29.03 L2.2 | v17.93,55.86 17.97,55.82 R18.1 | C12.1 30.57,26.33 v30.99,25.91 30.99,23.98 TP1.TP
  Route2 0.305: v27.43,39.88 26.59,39.04 v16.56,39.04 | v11.23,46.84 v28.19,46.84 | X2.1 35.08,12.22 28.42,12.22 X1.1
  Route15 0.305: v27.43,39.88 27.43,36.83 29.84,34.42 29.84,26.54 v29.97,26.42 30.48,26.92 30.48,34.8 28.19,37.08 v28.19,46.84 | v11.23,55.58 v11.23,46.84 | v16.56,39.04 16.56,54.49 v17.93,55.86
  Bottom 0.254: IC6.5 C14.1 13.91,31.75 14.99,31.75 15.24,31.5 15.24,24.13 14.56,23.45 IC5.5 C17.1 | 30.99,25.4 30.48,25.91 29.87,25.3 v29.87,25.15
  Bottom 0.305: R5.1 v11.22,46.83 v11.23,46.84 | v11.23,55.58 11.23,55.62 R1.1 | C14.1 13.86,32.21 13.3,32.77 LICK_0.3 | LICK_1.3 13.13,21.84 13.86,21.12 C17.1 14.71,20.83 15.14,21.26 29.74,21.26 30.38,21.89 30.38,26.01 | 30.48,25.91 30.38,26.01 | 30.38,26.01 v29.97,26.42 | X1.1 29.97,13.46 30.68,14.17 30.68,20.56 30.99,20.87 30.99,25.4
  pour Route2: 29.21,24.64 31.5,24.64 31.5,26.92 29.21,26.92
  pour Route15: 29.21,24.64 31.5,24.64 31.5,26.92 29.21,26.92
  pour Top: 29.21,24.64 31.5,24.64 31.5,26.92 29.21,26.92
  pour Route15: 29.21,24.64 31.5,24.64 31.5,26.92 29.21,26.92
  pour Bottom: 29.21,24.64 31.5,24.64 31.5,26.92 29.21,26.92
+3V3_U  (via drill 0.35)
  Top 0.203: 27.04,24.19 C26.1
  Top 0.254: 27.04,24.19 26.7,24.19 26.25,23.74 IC8.31 | OSC1.P$4 19.26,35.85 19.26,37.51 C25.1 19.06,38.73 19.57,39.24 22.04,39.24 SV2.6 24.35,38.9 26.19,38.9 26.8,38.29 26.8,30.5 v26.82,30.48 26.79,30.48 26.79,29.03 L2.1 | IC8.39 17.93,27.16 17.93,28.58 17.52,29.11 17.52,30.91 C27.1 17.98,31.21 18.49,30.7 v18.49,30.38 | IC8.9 9.18,18.94 C29.1 8.42,19.44 v7.72,18.75 | IC8.19 19.51,12.93 C28.1 20.24,12.19 25.45,12.19 25.96,12.7 v25.96,14.22 | L2.1 26.06,28.21 v26.06,27.38 v27.04,27.38 27.03,27.4 27.03,28.69 L2.1 | C26.1 26.23,24.24 v26.01,24.46 | R34.2 23.29,30.44 21.55,30.44 v21.54,30.43
  Route2 0.254: v18.49,30.38 21.49,30.38 v21.54,30.43 26.77,30.43 v26.82,30.48
  Route15 0.254: v26.06,27.38 26.02,27.35 26.02,24.48 v26.01,24.46 26.82,24.46 27.69,23.6 27.69,15.95 v25.96,14.22 | v27.04,27.38 27.04,25.28 28.45,23.88 v28.45,18.92
  Bottom 0.254: v28.45,18.92 27.94,18.92 27.76,18.75 v7.72,18.75
+5V  (via drill 0.35)  (1 unrouted)
  Top 0.254: IC1.20 17.23,51.69 16.46,52.45 C5.1
  Top 0.305: L1.1 26.64,43.2 C8.1 26.45,42.85 28.83,42.85 29.4,42.28 C10.1 29.4,39.34 29.87,38.87 | 29.87,38.87 30.38,38.37 30.88,38.86 | 30.64,38.86 TP13.TP | 29.87,38.87 29.15,38.15 IC3.3 29.15,38.7 v29.26,38.81 | 30.88,38.86 30.99,38.86 30.99,36.9 IC3.1 | C5.1 15.52,53.77 v15.09,53.34 | v30.48,38.86 30.88,38.86
  Route2 0.254: v15.09,53.34 15.34,53.59 29.46,53.59 v30.63,54.76
  Route2 0.305: v28.7,54.87 v14.09,54.87
  Route15 0.254: v30.63,54.76 30.63,39.01 v30.48,38.86
  Route15 0.305: v14.09,54.87 12.85,53.63 v12.85,48.31 | v29.26,38.81 29.41,38.81 30.02,39.42 30.02,53.54 v28.7,54.87
  Bottom 0.305: v12.85,48.31 v12.85,48.3 R6.1 | R2.1 13.51,55.62 14.09,55.04 v14.09,54.87
  pour Bottom: 28.7,39.52 28.7,38.1 31.09,38.1 31.24,38.25 31.24,39.52
  pour Route15: 28.7,39.52 28.7,38.1 31.24,38.1 31.24,39.52
  pour Route2: 28.7,39.52 28.7,38.1 31.24,38.1 31.24,39.52
  pour Top: 28.7,39.47 28.7,38.1 31.24,38.1 31.24,39.52 28.75,39.52
+12V
  Route2 0.406: REWARD_VALVES.4 6.45,8.38 7.34,9.27 7.34,14.63 8.2,15.49 31.88,15.49 35.39,19.01 X15.1 35.39,20.42 34.39,20.42 34.29,20.32 34.29,19.3 31.59,16.61 6.76,16.61 6.2,16.05 6.2,14.07 5.59,13.46 REWARD_VALVES.2
  Bottom 0.305: D4.3 3.59,8.34 REWARD_VALVES.4 | D1.3 9.11,13.66 3.75,13.66 REWARD_VALVES.2
FTDI_CTS  (via drill 0.35)
  Top 0.254: IC1.11 18.54,43.23 v18.54,41.35 | IC8.29 20.74,22.14 v19.81,23.06
  Route15 0.254: v18.54,41.35 19.81,40.08 v19.81,23.06
FTDI_RTS  (via drill 0.35)
  Top 0.254: IC8.28 22.61,21.34 21.69,20.42 v15.54,20.42 | IC1.3 13.31,43.22 13.31,40.93 12.55,40.16 v12.55,39.57
  Route15 0.254: v15.54,20.42 14.12,21.84 14.12,36.28 12.55,37.86 v12.55,39.57
FTDI_RXD  (via drill 0.35)
  Top 0.254: IC1.5 14.63,41.76 v15.24,41.15 | IC8.33 23.69,25.35 21.69,25.35 20.73,24.38 18.67,24.38 17.78,25.27 v17.02,25.27
  Route15 0.254: v15.24,41.15 15.24,27.05 v17.02,25.27
FTDI_TXD  (via drill 0.35)
  Top 0.254: IC1.1 12.03,40.44 11.57,39.99 11.57,39.28 12.95,37.9 v13.82,37.9 | IC8.32 | IC8.32 21.74,24.54 21.08,23.88 18.29,23.88 17.65,24.51 v16.13,24.51
  Route15 0.254: v13.82,37.9 14.68,37.03 14.68,25.96 v16.13,24.51
GND  (via drill 0.35)  (150 unrouted)
  Top 0.254: X2.10 32,3.3
  Top 0.305: X3.P$5 v32.42,50.86 v32.41,50.85 | C27.2 16.27,30.96 16.27,30.32 v16.61,29.97 | IC8.38 18.71,28.89 v18.69,28.91 | X1.10 23.11,3.3
  other vias: 28.04,33.76 25.3,25.4 2.29,30.23 2.03,19.05 2.29,41.15 5.59,2.54 12.19,1.74 20.77,1.64 30.38,1.69 29.46,5.84 40.89,6.6 38.1,10.41 40.89,20.57 41.15,36.83 9.68,25.35 20.83,55.88 5.59,55.88 17.53,44.96 37.08,55.88 23.77,50.85 16.41,19.56 18.44,23.01 11.43,13.72 9.91,5.59 1.78,6.35 6.86,34.04 7.06,23.27 20.07,5.59 22.35,8.64 11.28,31.24 11.53,37.69 32.21,37.69 33.27,41.66 9.7,53.14 6.76,44.81 8.64,39.88 21.79,23.37 15.49,7.62 41.4,12.45 15.14,11.79 8.23,12.34 20.32,13.72 10.62,19.76 16.31,37.69 20.57,38.1 20.62,32.11 16.21,32.56 40.89,28.19 28.45,17.4 39.12,15.75 38.61,24.38 38.35,31.75 25.93,33.32 21.97,28.57 12.14,27.48 9.14,29.46 30.07,9.55 40.89,43.18 24.43,48.87 21.69,50.7 23.37,44.96 21.84,42.93 18.54,32.36 31.75,30.23 28.75,30.33 22.35,32.77 18.95,11.33 15.39,55.88 17.53,48.72 20.07,47.65 14.78,48.46 8.64,48.26 13.97,44.96 21.13,52.88 21.39,48.92 28.65,52.88 24.33,52.78 28.24,51 25.65,22.96 14.88,17.53 19.51,19.56 19.46,17.53 18.95,25.5 32,55.88 31.5,52.83 29.16,43.89 32.21,39.73 16.15,34.95 32.36,25.3 32.51,32.26 35.81,38.1 32.77,45.21 35.48,17.65
  pour Bottom (rank 2): 2.79,56.9 1.02,55.12 1.02,2.79 3.05,0.76 40.39,0.76 42.16,2.54 42.16,54.36 39.62,56.9
  pour Top (rank 2): 2.79,56.9 1.02,55.12 1.02,2.79 3.05,0.76 40.39,0.76 42.16,2.54 42.16,54.36 39.62,56.9
  pour Route2 (rank 2): 2.79,56.9 1.02,55.12 1.02,2.79 3.05,0.76 40.39,0.76 42.16,2.54 42.16,54.36 39.62,56.9
  pour Route15 (rank 2): 2.79,56.9 1.02,55.12 1.02,2.79 3.05,0.76 40.39,0.76 42.16,2.54 42.16,54.36 39.62,56.9
HARP_H1_BOARD_RX  (via drill 0.35)
  Top 0.254: v21.87,17.68 21.89,17.65 21.89,15.54 IC8.22
  Route2 0.254: v24.13,26.31 27.18,26.31 28.88,28.02 X15.3 | X15.3
  Route15 0.254: v21.87,17.68 23.62,19.43 23.62,25.81 v24.13,26.31
HARP_H1_BOARD_TX  (via drill 0.35)
  Top 0.254: v26.92,17.4 26.86,17.34 IC8.23
  Route2 0.254: v26.94,23.09 30.55,23.09 31.87,24.41 35.28,24.41 X15.2
  Route15 0.254: v26.92,17.4 | v26.92,17.4 26.92,23.07 v26.94,23.09
HARP_H1_CLOCK_IN  (via drill 0.35)
  Top 0.254: IC8.12 13.91,19.14 v14.38,19.61
  Route2 0.254: v13.06,30.68 13.67,31.3 35.18,31.3 X15.4
  Route15 0.254: v13.06,30.68 13.11,30.63 13.11,20.88 v14.38,19.61
LED_STATE  (via drill 0.35)
  Top 0.254: IC8.36 20.31,29.3 v20.68,29.67 | STATE.A 12.65,12.18 12.24,11.77 v12.24,11.28
  Route2 0.254: v22.45,10.62 14.68,10.62 14.02,11.28 v12.24,11.28
  Route15 0.254: v22.45,10.62 22.45,15.03 20.65,16.83 20.65,29.64 v20.68,29.67
LICK_PORT_1
  Bottom 0.254: IC6.2 8.29,35.24 R9.2 8.22,35.31 LICK_0.2
LICK_PORT_2
  Bottom 0.254: IC5.2 R8.2 8.26,24.38 LICK_1.2
N$1
  Top 0.254: R3.2 39.89,55.49 39.89,53.16 X3.SHIELD_2
N$2
  Top 0.2: 29.75,47.95 IC7.P$4
  Top 0.203: X3.P$2 32.84,48.46 32.34,47.95 29.75,47.95
N$3
  Top 0.203: X3.P$3 33.03,49.26 32.45,49.84 IC7.P$6
N$4
  Bottom 0.203: CAM_TRIGGERS.4 6.03,43.81 8.36,41.49 IC2.4
N$5
  Bottom 0.203: 8.12,54.32 R2.2 R1.2 | C16.1 8.1,52.53 8.61,52.02 IC4.5
  Bottom 0.305: 8.12,54.32 C16.1
N$6
  Bottom 0.305: T1.3 13.97,11.25 13.18,12.04 9.2,12.04 8.72,11.57 D4.1 8.35,10.92 REWARD_VALVES.3
N$7
  cutout Top: 23.11,32 24.13,32 24.13,30.99 23.11,30.99
N$8
  Bottom 0.203: CAM_TRIGGERS.2 5.61,48.9 6.83,50.12 IC4.4
N$9
  Top 0.254: R10.2 STATE.C
N$10
  cutout Top: 15.49,23.22 15.49,23.62 17.27,23.62 17.27,23.22
N$11
  Top 0.254: TP4.TP 12.37,28.68 IC8.44
N$12  (via drill 0.35)
  Top 0.254: v11.29,26.55 11.29,25.64 11.6,25.34 IC8.1
  Bottom 0.254: v11.29,26.55 10.17,26.55 TP5.TP
N$13  (via drill 0.35)
  Top 0.203: v10.52,20.88 10.97,21.34 IC8.6
  Bottom 0.203: v10.52,20.88 9.35,20.88 TP6.TP
N$14
  Bottom 0.203: 8.81,45.21 8.81,43.95 IC2.5
  Bottom 0.254: R6.2 R5.2 8.89,45.53 8.77,45.65 C15.1 8.81,45.45 8.81,45.21
N$15
  Top 0.254: C2.1 34.33,53.42 X3.SHIELD_3
N$16
  cutout Top: 16.56,29.26 17.58,29.26 17.58,28.75 16.56,28.75
N$17
  Top 0.254: IC8.11 10.79,17.34 TP8.TP
N$18  (via drill 0.35)
  Top 0.254: v21.59,13.72 21.4,13.72 21.11,14.01 IC8.21
  Bottom 0.254: v21.59,13.72 TP9.TP
N$19
  cutout Route2: 1.02,7.11 1.02,17.27 5.84,17.27 arc2 5.84,7.11
N$20
  cutout Bottom: 10.16,15.49 10.16,14.48 9.65,14.48 9.65,15.49
N$21
  cutout Top: 1.02,7.11 1.02,17.27 5.84,17.27 arc2 5.84,7.11
N$22
  cutout Route15: 1.02,7.11 1.02,17.27 5.84,17.27 arc2 5.84,7.11
N$23
  cutout Bottom: 1.02,7.11 1.02,17.27 5.84,17.27 arc2 5.84,7.11
N$24
  cutout Top: 16.71,36.32 20.17,36.32 20.17,33.83 16.71,33.83
N$25
  cutout Top: 18.03,36.27 18.03,37.64 18.29,37.64 18.29,36.27
N$26
  cutout Top: 16.76,55.63 17.53,55.63 17.53,54.61 16.76,54.61
N$27
  cutout Top: 18.29,55.63 19.05,55.63 19.05,54.61 18.29,54.61
N$28
  cutout Route2: 1.02,20.57 1.02,26.67 5.84,26.67 arc2 5.84,20.57
N$29
  cutout Top: 1.02,20.57 1.02,26.67 5.84,26.67 arc2 5.84,20.57
N$30
  cutout Route15: 1.02,20.57 1.02,26.67 5.84,26.67 arc2 5.84,20.57
N$31
  cutout Bottom: 1.02,20.57 1.02,26.67 5.84,26.67 arc2 5.84,20.57
N$32
  cutout Route2: 0.76,42.42 0.76,51.05 5.08,51.05 5.08,47.75 3.3,47.75 3.3,44.96 5.08,44.96 5.08,42.42
N$33
  cutout Top: 0.76,42.42 0.76,51.05 5.08,51.05 5.08,47.75 3.3,47.75 3.3,44.96 5.08,44.96 5.08,42.42
N$34
  cutout Route15: 0.76,42.42 0.76,51.05 5.08,51.05 5.08,47.75 3.3,47.75 3.3,44.96 5.08,44.96 5.08,42.42
N$35
  cutout Bottom: 0.76,42.42 0.76,51.05 5.08,51.05 5.08,47.75 3.3,47.75 3.3,44.96 5.08,44.96 5.08,42.42
N$36
  cutout Route2: 1.02,31.5 1.02,37.59 5.84,37.59 arc2 5.84,31.5
N$37
  cutout Top: 1.02,31.5 1.02,37.59 5.84,37.59 arc2 5.84,31.5
N$38
  Top 0.203: IC1.17 19.18,52.6 19.59,53.01 C7.1
N$39
  cutout Route15: 1.02,31.5 1.02,37.59 5.84,37.59 arc2 5.84,31.5
N$40
  cutout Bottom: 1.02,31.5 1.02,37.59 5.84,37.59 arc2 5.84,31.5
N$41
  cutout Route2: 23.37,2.03 23.37,14.99 28.45,14.99 28.45,7.11 25.91,7.11 25.91,4.57 28.45,4.57 28.45,2.03
N$42
  cutout Top: 23.37,2.03 23.37,14.99 28.45,14.99 28.45,7.11 25.91,7.11 25.91,4.57 28.45,4.57 28.45,2.03
N$43
  cutout Route15: 23.37,2.03 23.37,14.99 28.45,14.99 28.45,7.11 25.91,7.11 25.91,4.57 28.45,4.57 28.45,2.03
N$44
  cutout Bottom: 23.37,2.03 23.37,14.99 28.45,14.99 28.45,7.11 25.91,7.11 25.91,4.57 28.45,4.57 28.45,2.03
N$45
  cutout Top: 18.19,51.51 18.95,51.51 18.95,51.26 18.19,51.26
N$46
  cutout Top: 19.91,52.22 19.91,53.24 20.17,53.24 20.17,52.22
N$47
  cutout Top: 20.57,51.31 20.57,52.07 20.83,52.07 20.83,51.31
N$48
  cutout Top: 27.69,50.29 28.7,50.29 28.7,47.5 27.69,47.5
N$49
  cutout Route2: 32.51,1.78 32.51,14.99 37.34,14.99 37.34,7.11 35.05,7.11 35.05,4.52 37.59,4.52 37.59,1.78
N$50
  cutout Top: 32.51,1.78 32.51,14.99 37.34,14.99 37.34,7.11 35.05,7.11 35.05,4.52 37.59,4.52 37.59,1.78
N$51
  cutout Route15: 32.51,1.78 32.51,14.99 37.34,14.99 37.34,7.11 35.1,7.11 35.1,4.52 37.59,4.52 37.59,1.78
N$52
  cutout Bottom: 32.51,1.78 32.51,14.99 37.34,14.99 37.34,7.11 35.05,7.11 35.05,4.52 37.59,4.52 37.59,1.78
N$53
  cutout Bottom: 10.36,9.91 10.36,8.89 9.86,8.89 9.86,9.91
N$54
  cutout Top: 27.13,46.28 27.89,46.28 27.89,44.5 27.13,44.5
N$55
  cutout Top: 27.84,27.48 27.08,27.48 27.08,29.77 27.84,29.77
N$56
  cutout Top: 27.23,25.1 27.23,26.11 28.24,26.11 28.24,25.1
N$57
  cutout Top: 16.51,10.41 17.78,10.41 17.78,10.16 16.51,10.16
N$58
  cutout Route2: 26.57,41.4 26.57,33.78 23.16,33.78 23.16,36.32 21.84,36.32 21.84,41.4
N$59
  cutout Top: 20.02,19.15 20.02,20.17 20.27,20.17 20.27,19.15
N$60
  cutout Top: 26.57,41.4 26.57,33.78 23.16,33.78 23.16,36.32 21.84,36.32 21.84,41.4
N$61
  cutout Route15: 26.57,41.4 26.57,33.78 22.1,33.78 23.16,33.78 23.16,36.32 21.84,36.32 21.84,41.4
N$62
  cutout Bottom: 26.57,41.4 26.57,33.78 23.11,33.78 23.11,34.54 23.16,34.54 23.16,36.32 21.84,36.32 21.84,41.4
N$63
  cutout Bottom: 8.64,55.37 9.4,55.37 9.4,55.12 8.64,55.12
N$64
  cutout Bottom: 13.21,54.36 13.97,54.36 13.97,54.61 13.21,54.61
N$65
  cutout Bottom: 13.46,46.48 13.46,45.72 13.21,45.72 13.21,46.48
N$66
  cutout Bottom: 11.68,47.24 12.45,47.24 12.45,46.99 11.68,46.99
N$67
  cutout Bottom: 9.14,46.74 9.65,46.74 9.65,46.48 9.14,46.48
N$68
  Bottom 0.254: 12.43,17.38 13.46,17.38 13.97,16.88 T2.3
  Bottom 0.305: 12.43,17.38 9.38,17.38 8.52,16.52 D1.1 8.1,15.8 3.76,15.8 REWARD_VALVES.1
N$69
  cutout Top: 22.15,17.17 22.91,17.17 22.91,16.92 22.15,16.92
N$70
  cutout Top: 4.88,2.44 4.88,0.05 4.62,0.05 4.62,2.44
N$71
  cutout Top: 2.57,4.34 0.69,4.34 0.69,4.6 2.57,4.6
N$72
  cutout Route2: 2.57,4.34 0.69,4.34 0.69,4.6 2.57,4.6
N$73
  cutout Route15: 2.57,4.34 0.69,4.34 0.69,4.6 2.57,4.6
N$74
  cutout Bottom: 2.57,4.34 0.69,4.34 0.69,4.6 2.57,4.6
N$75
  cutout Top: 38.71,56.13 38.71,56.54 40.49,56.54 40.49,56.13
N$76
  cutout Top: 39.17,53.39 38.76,53.39 38.76,55.17 39.17,55.17
N$77
  cutout Top: 34.19,50.14 34.19,49.73 32.41,49.73 32.41,50.14
N$78
  cutout Route15: 14.99,19.56 15.49,20.07 14.73,20.07 14.73,19.56
N$79
  cutout Route2: 4.88,2.44 4.88,0.05 4.62,0.05 4.62,2.44
N$80
  cutout Route15: 4.88,2.44 4.88,0.05 4.62,0.05 4.62,2.44
N$81
  cutout Bottom: 4.88,2.44 4.88,0.05 4.62,0.05 4.62,2.44
N$82
  cutout Top: 38.35,2.34 38.35,0.46 38.1,0.46 38.1,2.34
N$83
  cutout Route2: 38.35,2.34 38.35,0.46 38.1,0.46 38.1,2.34
N$84
  cutout Route15: 38.35,2.34 38.35,0.46 38.1,0.46 38.1,2.34
N$85
  cutout Bottom: 38.35,2.34 38.35,0.46 38.1,0.46 38.1,2.34
N$86
  cutout Top: 42.29,4.34 40.41,4.34 40.41,4.6 42.29,4.6
N$87
  cutout Route2: 42.29,4.34 40.41,4.34 40.41,4.6 42.29,4.6
N$88
  cutout Route15: 42.29,4.34 40.41,4.34 40.41,4.6 42.29,4.6
N$89
  cutout Bottom: 42.29,4.34 40.41,4.34 40.41,4.6 42.29,4.6
N$90
  cutout Top: 2.54,53.09 0.66,53.09 0.66,53.34 2.54,53.34
N$91
  cutout Route2: 2.54,53.09 0.66,53.09 0.66,53.34 2.54,53.34
N$92
  cutout Route15: 2.54,53.09 0.66,53.09 0.66,53.34 2.54,53.34
N$93
  cutout Bottom: 2.54,53.09 0.66,53.09 0.66,53.34 2.54,53.34
N$94
  cutout Top: 4.83,57.35 4.83,55.47 4.57,55.47 4.57,57.35
N$95
  cutout Route2: 4.83,57.35 4.83,55.47 4.57,55.47 4.57,57.35
N$96
  cutout Route15: 4.83,57.35 4.83,55.47 4.57,55.47 4.57,57.35
N$97
  cutout Bottom: 4.83,57.35 4.83,55.47 4.57,55.47 4.57,57.35
N$98
  cutout Route15: 21.34,19.56 21.34,17.78 21.84,17.78 21.84,19.56
N$99
  cutout Route15: 24.13,27.94 24.13,26.16 23.88,26.16 23.88,27.94
N$100
  cutout Route15: 28.35,43.13 28.35,43.54 30.12,43.54 30.12,43.13
N$101
  cutout Top: 31.5,39.52 30.07,39.52 30.07,41.5 31.5,41.5
N$102
  cutout Route2: 34.04,17.27 34.04,14.73 33.02,14.73 33.02,17.27
N$106
  cutout Top: 18.08,31.5 19.35,31.5 19.35,31.19 18.08,31.19
N$107
  cutout Top: 19.81,30.84 21.08,30.84 21.08,30.53 19.81,30.53
N$108
  cutout Top: 31.55,46.48 34.09,46.48 34.09,46.18 31.55,46.18
N$109
  cutout Route15: 29.87,22.5 31.65,22.5 31.65,22.25 29.87,22.25
N$110
  cutout Route15: 17.58,25.3 17.58,20.17 15.65,20.17 15.65,25.3
N$111
  cutout Route15: 29.21,10.36 30.99,10.36 30.99,10.11 29.21,10.11
N$175
  Top 0.203: 17.86,53.38 17.86,50.5
  Top 0.254: IC1.19 17.86,50.5 | 17.86,53.38 R18.2
OSC2
  Top 0.254: OSC1.P$3 19.51,33.5 IC8.37
PDI_CLK
  Top 0.254: IC8.35 21.11,28.91 21.64,29.45 24.62,29.45 24.74,29.58 R34.1 24.95,30.63 C13.1 25.08,32.59 25.08,35.23 SV2.1
PDI_DATA  (via drill 0.35)
  Top 0.305: IC8.34 21.91,27.43 23.11,27.43 v23.62,27.94
  Route15 0.254: v23.62,27.94 23.62,33.53 24.38,34.29 24.38,39.04 SV2.5
U_CAM1_TRIGGER  (via drill 0.35)
  Top 0.254: IC8.10 9.06,18.14 v8.89,17.97
  Route15 0.254: v10.41,49.12 10.41,24.72 8.89,23.2 v8.89,17.97
  Bottom 0.203: IC4.2 11.14,51.08 10.36,50.3 10.36,49.07
  Bottom 0.254: 10.36,49.07 v10.41,49.12
U_CAM2_TRIGGER  (via drill 0.35)
  Top 0.254: IC8.20 20.31,19.29 20.65,19.63 v21.82,19.63
  Route15 0.254: v21.34,41.4 21.34,32 22.86,30.48 22.86,20.68 v21.82,19.63
  Bottom 0.254: v21.34,41.4 20.3,42.44 IC2.2
U_LICK_PORT_1  (via drill 0.35)
  Top 0.254: v16.05,36.21 15.18,35.35 15.18,30.22 17.11,28.3 IC8.40
  Bottom 0.254: v16.05,36.21 16.02,36.19 IC6.4
U_LICK_PORT_2  (via drill 0.35)
  Top 0.254: IC8.41 16.31,28.15 14.99,29.47 12.34,29.47 v12.29,29.52
  Bottom 0.254: v12.29,29.52 13.86,27.95 IC5.4
U_OPTICAL_FLOW_1_CS  (via drill 0.35)
  Top 0.254: IC8.14 15.51,13.22 v15.49,13.21
  Route2 0.254: v15.49,13.21 16,12.7 23.37,12.7 24.13,13.46 X1.2
U_OPTICAL_FLOW_1_INT  (via drill 0.35)
  Top 0.254: v16,22.61 15.67,22.94 IC8.4
  Route2 0.254: v16,22.61 16.46,22.15 29.41,22.15 v29.62,22.35
  Route15 0.254: v29.62,22.35 29.21,21.95 29.21,10.16 28.7,9.65 25.91,9.65 X1.6
U_OPTICAL_FLOW_1_MISO  (via drill 0.35)
  Top 0.254: IC8.16 17.11,11.22 18.12,10.2 18.12,6.08 v18.11,6.07
  Route2 0.254: v18.11,6.07 19.15,7.11 25.91,7.11 X1.5
U_OPTICAL_FLOW_1_MOSI  (via drill 0.35)
  Top 0.254: v15.9,9.91 16.31,10.31 IC8.15
  Route2 0.254: v15.9,9.91 24.28,9.91 24.64,10.26 X1.4
U_OPTICAL_FLOW_1_SCK  (via drill 0.35)
  Top 0.254: IC8.17 v17.91,11.76
  Route2 0.254: v17.91,11.76 18.26,12.12 25.98,12.12 X1.3
U_OPTICAL_FLOW_2_CS
  Top 0.254: IC8.24 32.6,18.14 33.78,16.95 X2.2
U_OPTICAL_FLOW_2_INT  (via drill 0.35)
  Top 0.254: v14.99,22.1 12.14,22.1 IC8.5
  Route2 0.254: v14.99,22.1 15.49,21.59 31.24,21.59 v31.75,22.1
  Route15 0.254: v31.75,22.1 29.97,20.32 29.97,11.18 32.26,8.89 33.27,8.89 X2.6
U_OPTICAL_FLOW_2_MISO  (via drill 0.35)
  Top 0.254: v31.52,20.27 31.39,20.4 27.67,20.4 27.01,19.74 IC8.26
  Route15 0.254: X2.5 35.05,9.65 32.51,9.65 30.63,11.53 30.63,19.76 31.14,20.27 v31.52,20.27
U_OPTICAL_FLOW_2_MOSI  (via drill 0.35)
  Top 0.254: v31.5,18.95 30.75,19.7 28.02,19.7 27.26,18.94 IC8.25
  Route15 0.254: X2.4 32.26,10.92 31.5,11.68 v31.5,18.95
U_OPTICAL_FLOW_2_SCK  (via drill 0.35)
  Top 0.254: v32.36,20.98 31.99,21.35 27.57,21.35 26.75,20.54 IC8.27
  Route15 0.254: v32.36,20.98 32.36,12.85 33.02,12.19 35.05,12.19 X2.3
U_REWARD_VALVE_1  (via drill 0.35)
  Top 0.254: IC8.2 12.12,24.52 13.2,24.52 13.95,23.77 v17.27,23.77
  Route15 0.254: v17.27,23.77 17.27,13.99 17.75,13.51 v18.67,13.51
  Bottom 0.254: v18.67,13.51 17.61,14.57 R4.2 14.68,14.57 T2.1
U_REWARD_VALVE_2  (via drill 0.35)
  Top 0.254: IC8.3 10.78,23.74 9.91,22.86 v9.65,22.86
  Route2 0.254: v19.71,8.79 v11.89,8.79
  Route15 0.254: v9.65,22.86 9.65,11.02 v11.89,8.79
  Bottom 0.254: v19.71,8.79 19.48,9.02 R7.2 14.66,9.02 T1.1
USB_POWER  (via drill 0.35)
  Top 0.254: 28.65,45.61 L1.2 | 29.77,48.87 IC7.P$5
  Top 0.305: 28.65,45.61 C3.1 31.28,46.78 31.59,47.08 v31.6,47.09 v31.61,47.08 33.47,47.08 34.05,47.66 X3.P$1 | v31.6,48.87 29.77,48.87
  Bottom 0.305: v31.6,48.87 v31.6,47.09
USBDM
  Top 0.203: IC1.16 19.83,51.71 20.32,52.2 22.68,52.2 | IC7.P$1 23.22,49.84 22.73,50.34 C6.1
  Top 0.254: 22.68,52.2 C6.1
USBDP
  Top 0.203: IC1.15 20.48,48.4 20.93,47.95 C4.1 | IC7.P$3 C4.1
  Top 0.305: C4.1

### Text on the board
tPlace: GND | T0 | GND | T1 | GND | GND | IN | 3V3 | CLK_IN | RX | GND | IN | TX | 3V3 | 12V_IN | V0 | 12V | V1 | 12V | 0 | 1 | v1.0
tTest: camm_trigg_1 | camm_trigg_2 | lick_port_1 | lick_port_2 | reward_valve_1 | reward_valve_2 | Optical_flow_1 | Optical_flow_2